# Altium project FMC_ADC.PrjPcb (part 3 of 4)

## Sheet ANALOG_INPUT.SchDoc: Analog Input
size A3; Author: Wojciech Ruc³o; Organization: Warsaw Univeristy of Technology; Address1: Nowowiejska 15/19; DocumentNumber: 3; Revision: 1.0; SheetNumber: 3; SheetTotal: 12
Used 4 times, as channels U_ANALOG_INPUT_D, U_ANALOG_INPUT_C, U_ANALOG_INPUT_B, U_ANALOG_INPUT_A. Parts and nets are listed once, with the designators drawn on the sheet.
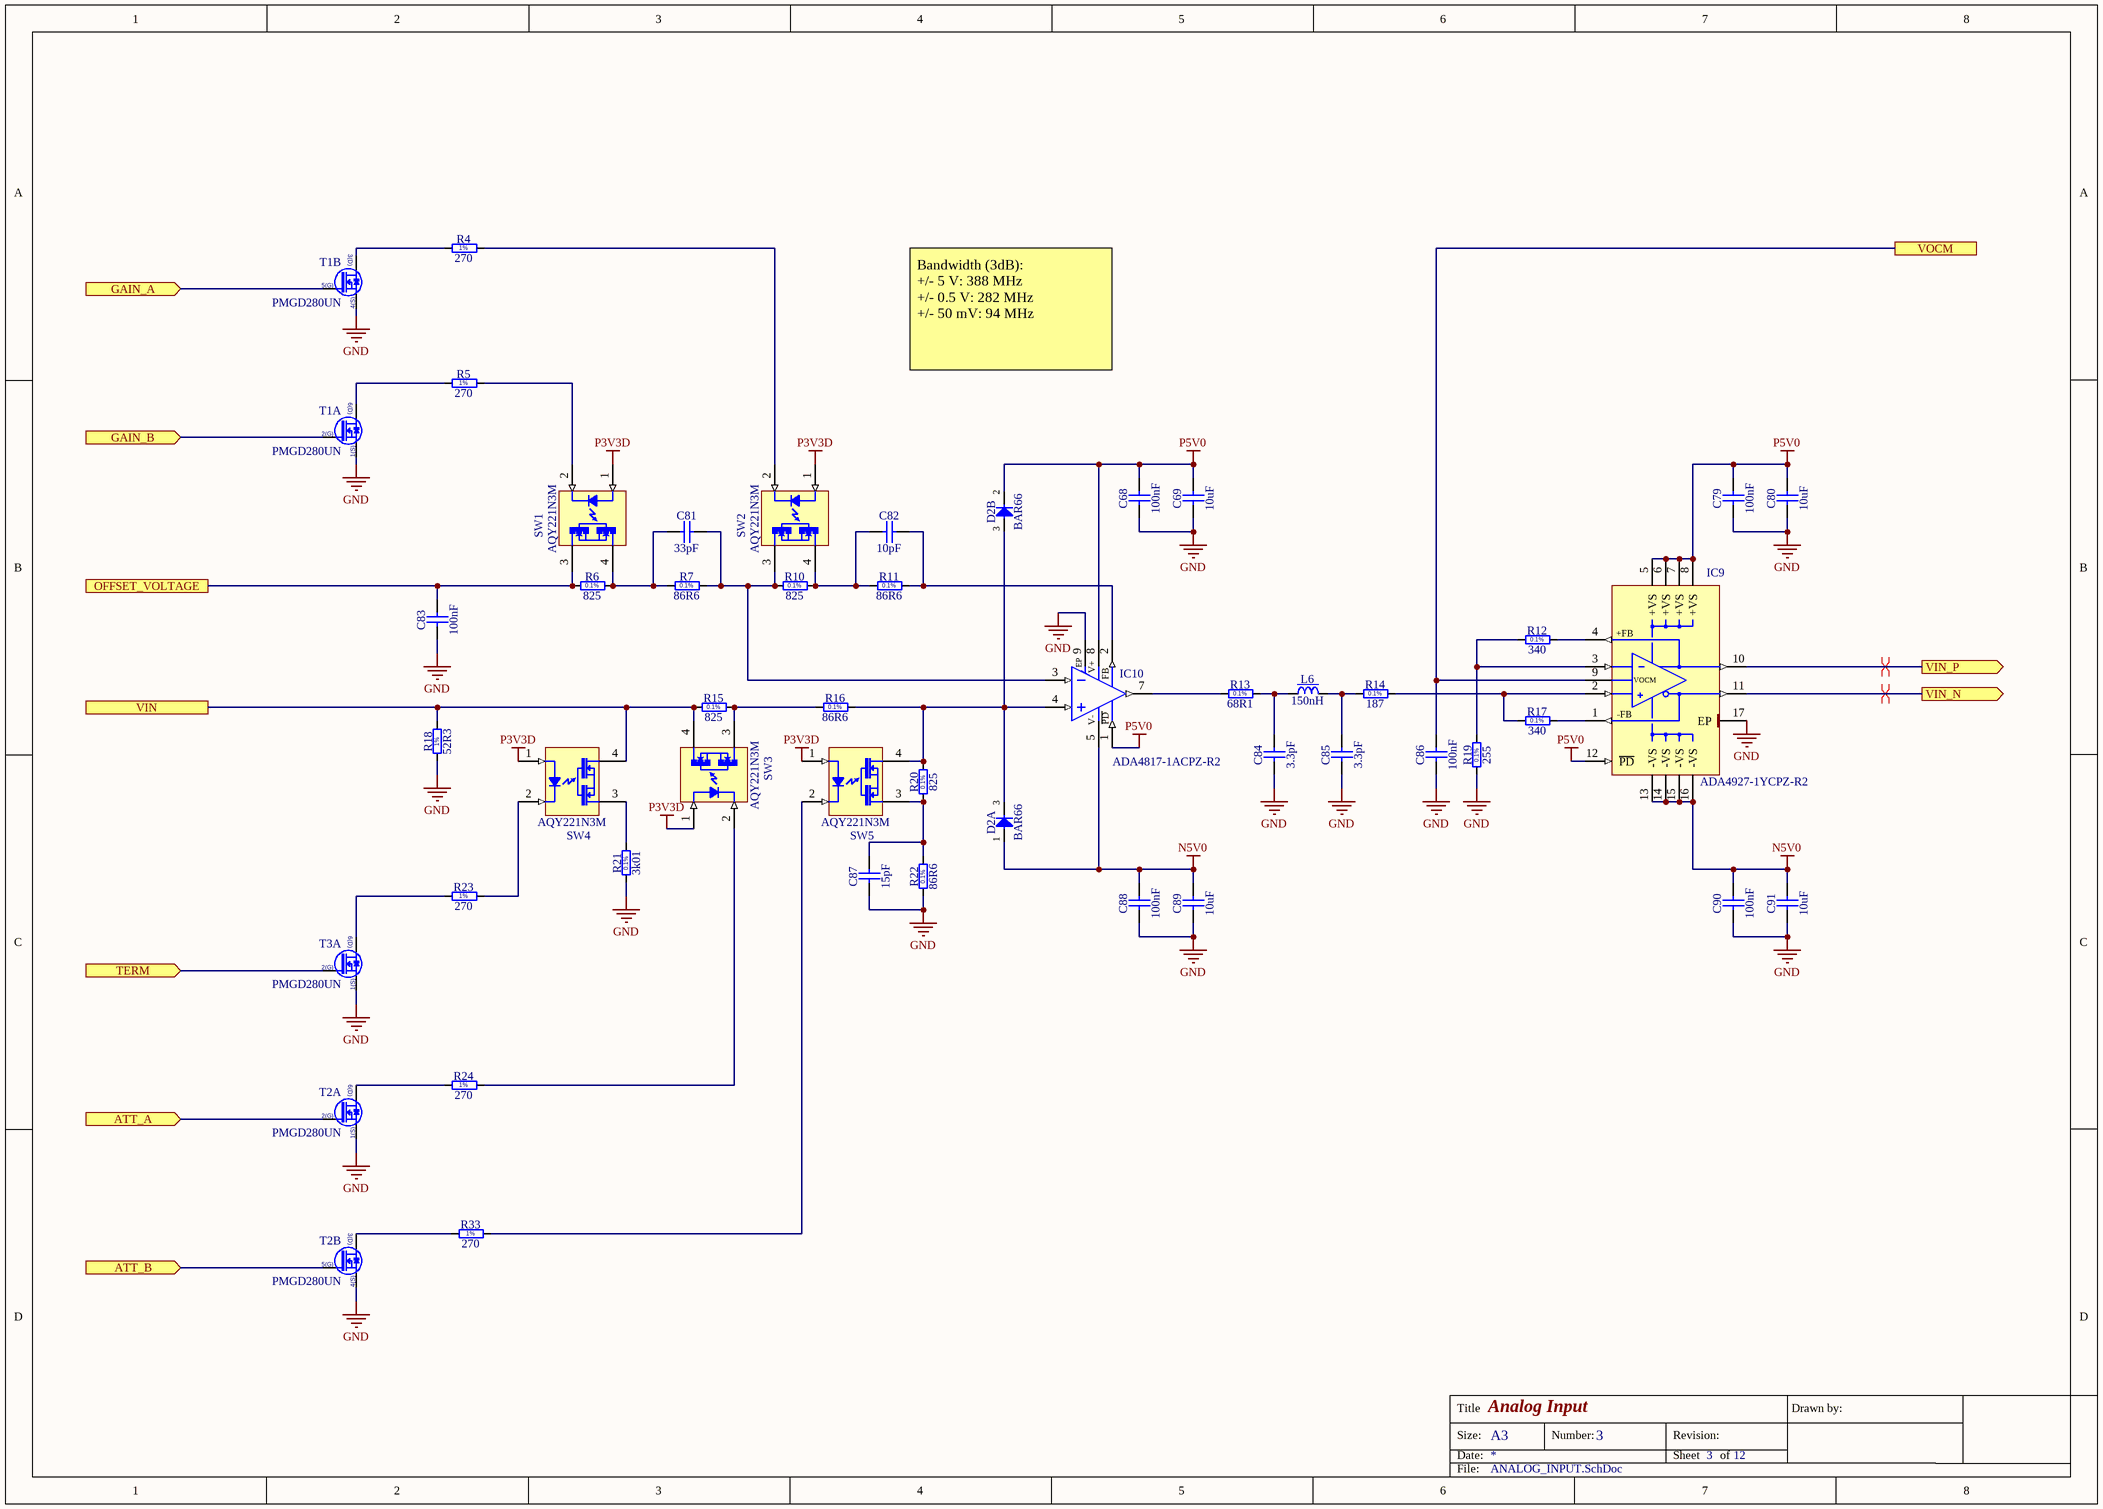
[diagram p6: ANALOG_INPUT.SchDoc]

### Parts
C68  100nF  [CAPC1005X55N]
C69  10uF  [CAPC1608X80N]
C79  100nF  [CAPC1005X55N]
C80  10uF  [CAPC1608X80N]
C81  33pF  [CAPC1608X87N]
C82  10pF  [CAPC1608X87N]
C83  100nF  [CAPC1005X55N]
C84  3.3pF  [CAPC1005X55N]
C85  3.3pF  [CAPC1005X55N]
C86  100nF  [CAPC1005X55N]
C87  15pF  [CAPC1005X55N]
C88  100nF  [CAPC1005X55N]
C89  10uF  [CAPC1608X80N]
C90  100nF  [CAPC1005X55N]
C91  10uF  [CAPC1608X80N]
D2  BAR66  [SOT95P240X110-3N]  (parts A,B of 2)
IC9  ADA4927-1YCPZ-R2  [QFN50P300X300X100-17N-S145]
IC10  ADA4817-1ACPZ-R2  [SON50P300X300X90-9N-R160X189]
L6  150nH  [IND_COILCRAFT_0805CS]
R4  270  [RESC1608X55N]
R5  270  [RESC1608X55N]
R6  825  [RESC1608X55N]
R7  86R6  [RESC1608X55N]
R10  825  [RESC1608X55N]
R11  86R6  [RESC1608X55N]
R12  340  [RESC1608X55N]
R13  68R1  [RESC1608X55N]
R14  187  [RESC1608X55N]
R15  825  [RESC1608X55N]
R16  86R6  [RESC1608X55N]
R17  340  [RESC1608X55N]
R18  52R3  [RESC6331X70N]
R19  255  [RESC1608X55N]
R20  825  [RESC1608X55N]
R21  3k01  [RESC1608X55N]
R22  86R6  [RESC1608X55N]
R23  270  [RESC1608X55N]
R24  270  [RESC1608X55N]
R33  270  [RESC1608X55N]
SW1  AQY221N3M  [PANASONIC_AQY22(SON)]
SW2  AQY221N3M  [PANASONIC_AQY22(SON)]
SW3  AQY221N3M  [PANASONIC_AQY22(SON)]
SW4  AQY221N3M  [PANASONIC_AQY22(SON)]
SW5  AQY221N3M  [PANASONIC_AQY22(SON)]
T1  PMGD280UN  [SOT65P210X110-6N]  (parts A,B of 2)
T2  PMGD280UN  [SOT65P210X110-6N]  (parts A,B of 2)
T3  PMGD280UN  [SOT65P210X110-6N]  (part A of 2)

### Ports
ATT_A (in), ATT_B (in), GAIN_A (in), GAIN_B (in), OFFSET_VOLTAGE, TERM (in), VIN, VIN_N (out), VIN_P (out), VOCM

### Nets
GND: C68.1 C69.1 C79.1 C80.1 C83.1 C84.1 C85.1 C86.1 C87.1 C88.1 C89.1 C90.1 C91.1 IC9.17(EP) IC10.9(EP) R18.1 R19.1 R21.1 R22.1 T1.1(S) T1.4(S) T2.1(S) T2.4(S) T3.1(S)
N5V0: C88.2 C89.2 C90.2 C91.2 D2.1(A) IC9.13(-VS) IC9.14(-VS) IC9.15(-VS) IC9.16(-VS) IC10.5(-Vs)
P3V3D: SW1.1(A) SW2.1(A) SW3.1(A) SW4.1(A) SW5.1(A)
P5V0: C68.2 C69.2 C79.2 C80.2 D2.2(C) IC9.5(+VS) IC9.6(+VS) IC9.7(+VS) IC9.8(+VS) IC9.12(~{PD}) IC10.1(~{PD}) IC10.8(+Vs)
ATT_A: T2.2(G) ; port ATT_A
ATT_B: T2.5(G) ; port ATT_B
GAIN_A: T1.5(G) ; port GAIN_A
GAIN_B: T1.2(G) ; port GAIN_B
OFFSET_VOLTAGE: C83.2 R6.1 SW1.3(C) ; port OFFSET_VOLTAGE
TERM: T3.2(G) ; port TERM
VIN: R15.1 R18.2 SW3.4(E) SW4.4(E) ; port VIN
VIN_N: IC9.11(-OUT) ; port VIN_N
VIN_P: IC9.10(+OUT) ; port VIN_P
VOCM: C86.2 IC9.9(VOCM) ; port VOCM
NetC81_1: C81.1 R6.2 R7.1 SW1.4(E)
NetC81_2: C81.2 IC10.3(IN-) R7.2 R10.1 SW2.3(C)
NetC82_1: C82.1 R10.2 R11.1 SW2.4(E)
NetC82_2: C82.2 IC10.2(FB) R11.2
NetC84_2: C84.2 L6.1 R13.2
NetC85_2: C85.2 L6.2 R14.1
NetC87_2: C87.2 R20.1 R22.2 SW5.3(C)
NetD2_3: D2.3(COMAC) IC10.4(IN+) R16.2 R20.2 SW5.4(E)
NetIC9_1: IC9.1(-FB) R17.2
NetIC9_2: IC9.2(+IN) R14.2 R17.1
NetIC9_3: IC9.3(-IN) R12.1 R19.2
NetIC9_4: IC9.4(+FB) R12.2
NetIC10_7: IC10.7(OUT) R13.1
NetR4_1: R4.1 T1.3(D)
NetR4_2: R4.2 SW2.2(K)
NetR5_1: R5.1 T1.6(D)
NetR5_2: R5.2 SW1.2(K)
NetR15_2: R15.2 R16.1 SW3.3(C)
NetR21_2: R21.2 SW4.3(C)
NetR23_1: R23.1 T3.6(D)
NetR23_2: R23.2 SW4.2(K)
NetR24_1: R24.1 T2.6(D)
NetR24_2: R24.2 SW3.2(K)
NetR33_1: R33.1 T2.3(D)
NetR33_2: R33.2 SW5.2(K)

### Channels
U_ANALOG_INPUT_D: designators end in A; ports ATT_A=ATT_A_CH4 ATT_B=ATT_B_CH4 GAIN_A=GAIN_A_CH4 GAIN_B=GAIN_B_CH4 OFFSET_VOLTAGE=OFFSET_CH4 TERM=LA06_N VIN=NetJ4_1 VIN_N=VIND_N VIN_P=VIND_P VOCM=VOCM
U_ANALOG_INPUT_C: designators end in B; ports ATT_A=ATT_A_CH3 ATT_B=ATT_B_CH3 GAIN_A=GAIN_A_CH3 GAIN_B=GAIN_B_CH3 OFFSET_VOLTAGE=OFFSET_CH3 TERM=LA09_P VIN=NetJ3_1 VIN_N=VINC_N VIN_P=VINC_P VOCM=VOCM
U_ANALOG_INPUT_B: designators end in C; ports ATT_A=ATT_A_CH2 ATT_B=ATT_B_CH2 GAIN_A=GAIN_A_CH2 GAIN_B=GAIN_B_CH2 OFFSET_VOLTAGE=OFFSET_CH2 TERM=LA25_N VIN=NetJ2_1 VIN_N=VINB_N VIN_P=VINB_P VOCM=VOCM
U_ANALOG_INPUT_A: designators end in D; ports ATT_A=ATT_A_CH1 ATT_B=ATT_B_CH1 GAIN_A=GAIN_A_CH1 GAIN_B=GAIN_B_CH1 OFFSET_VOLTAGE=OFFSET_CH1 TERM=LA26_P VIN=NetJ1_1 VIN_N=VINA_N VIN_P=VINA_P VOCM=VOCM

### Layout directives
differential pair: VIND_N, VIND_P

### Notes on the sheet
- Bandwidth (3dB):
  +/- 5 V: 388 MHz
  +/- 0.5 V: 282 MHz
  +/- 50 mV: 94 MHz
- Title
- Size:
- Date:
- A3
- Number:
- Revision:
- Sheet
- of
- Drawn by:
- File:
- (in symbol ADA4817-1ACPZ-R2) V+; PD; V-
- (in symbol PMGD280UN, part A) 6(D); 2(G); 1(S)
- (in symbol PMGD280UN, part B) 3(D); 5(G); 4(S)
- (in symbol R0603_3K01_0.1%_0.063W_10PPM) 0.1%
- (in symbol R0603_68R1_0.1%_0.063W_10PPM) 0.1%
- (in symbol R0603_86R6_0.1%_0.1W_15PPM) 0.1%
- (in symbol R0603_187R_0.1%_0.063W_10PPM) 0.1%
- (in symbol R0603_255R_0.1%_0.063W_10PPM) 0.1%
- (in symbol R0603_270R_1%_0.1W_100PPM) 1%
- (in symbol R0603_340R_0.1%_0.063W_10PPM) 0.1%
- (in symbol R0603_825R_0.1%_0.063W_10PPM) 0.1%
- (in symbol R2512_52R3_1%_1W_100PPM) 1%

### Library data of the parts
C68 C79 C83 C86 C88 C90 = CC0402_100NF_16V_10%_X7R: Non-polarised capacitor; Part Description: SMD Multilayer Chip Ceramic Capacitor; Manufacturer: GENERIC; Manufacturer1 Part Number: GRM155R71C104KA88D; Voltage: 16V; TC: X7R; Tolerance: ±10%; Part Number: CC0402_100NF_16V_10%_X7R; Component Kind: Standard; Component Type: Standard; Pin Count: 2; Value: 100nF; Status: Not Recommended; Manufacturer Part Number: CC0402_100NF_16V_10%_X7R; Case: 0402; Mounted: Yes; Socket: No; SMD: Yes; Sense: No; Manufacturer1 Example: MURATA; Manufacturer1 ComponentHeight: 0.55mm; HelpURL: \\cern.ch\dfs\Applications\Altium\Datasheets\CC0402_X7R_MURATA_GRM.pdf; Author: CERN DEM JLC; CreateDate: 05.12.2013; LatestRevisionDate: 03.12.2007
C69 C80 C89 C91 = CC0603_10UF_16V_20%_X5R: Non-polarised capacitor; Part Description: SMD Multilayer Chip Ceramic Capacitor; Manufacturer: GENERIC; Manufacturer1 Part Number: GRM188R61C106MA73D; Voltage: 16V; TC: X5R; Tolerance: ±20%; Part Number: CC0603_10UF_16V_20%_X5R; Component Kind: Standard; Component Type: Standard; Pin Count: 2; Value: 10uF; Status: None; Manufacturer Part Number: CC0603_10UF_16V_20%_X5R; Case: 0603; Mounted: Yes; Socket: No; SMD: Yes; Sense: No; Manufacturer1 Example: MURATA; Manufacturer1 ComponentHeight: 0.8mm; HelpURL: \\cern.ch\dfs\Applications\Altium\Datasheets\CC0603_X5R_MURATA_GRM.pdf; Author: CERN DEM MR; CreateDate: 02.03.2016; LatestRevisionDate: 02.03.2016
C81 = CC0603_33PF_50V_5%_NP0: Non-polarised capacitor; Part Description: SMD Multilayer Chip Ceramic Capacitor; Manufacturer: GENERIC; Manufacturer1 Part Number: 223886715339; Voltage: 50V; TC: C0G/NP0; Tolerance: ±5%; Part Number: CC0603_33PF_50V_5%_NP0; Component Kind: Standard; Component Type: Standard; Pin Count: 2; Value: 33pF; Status: Preferred; Manufacturer Part Number: CC0603_33PF_50V_5%_NP0; Case: 0603; Mounted: Yes; Socket: No; SMD: Yes; Sense: No; Manufacturer1 Example: PHYCOMP; Manufacturer1 ComponentHeight: 0.87mm; HelpURL: \\cern.ch\dfs\Applications\Altium\Datasheets\CC0603_NP0_PHYCOMP.pdf; Author: CERN DEM JLC; CreateDate: 03.12.2007; LatestRevisionDate: 03.12.2007
C82 = CC0603_10PF_50V_5%_NP0: Non-polarised capacitor; Part Description: SMD Multilayer Chip Ceramic Capacitor; Manufacturer: GENERIC; Manufacturer1 Part Number: 223886715109; Voltage: 50V; TC: C0G/NP0; Tolerance: ±5%; Part Number: CC0603_10PF_50V_5%_NP0; Component Kind: Standard; Component Type: Standard; Pin Count: 2; Value: 10pF; Status: Preferred; Manufacturer Part Number: CC0603_10PF_50V_5%_NP0; Case: 0603; Mounted: Yes; Socket: No; SMD: Yes; Sense: No; Manufacturer1 Example: PHYCOMP; Manufacturer1 ComponentHeight: 0.87mm; HelpURL: \\cern.ch\dfs\Applications\Altium\Datasheets\CC0603_NP0_PHYCOMP.pdf; Author: CERN DEM JLC; CreateDate: 03.12.2007; LatestRevisionDate: 03.12.2007
C84 C85 = CC0402_3.3PF_50V_0.25PF_C0G: Non-polarised capacitor; Part Description: SMD Multilayer Chip Ceramic Capacitor; Manufacturer: GENERIC; Manufacturer1 Part Number: C0402C339C5GACTU; Voltage: 50V; TC: C0G/NP0; Tolerance: ±0.25pF; Part Number: CC0402_3.3PF_50V_0.25PF_C0G; Component Kind: Standard; Component Type: Standard; Pin Count: 2; Value: 3.3pF; Status: Preferred; Manufacturer Part Number: CC0402_3.3PF_50V_0.25PF_C0G; Case: 0402; Mounted: Yes; Socket: No; SMD: Yes; Sense: No; Manufacturer1 Example: KEMET; Manufacturer1 ComponentHeight: 0.55mm; HelpURL: \\cern.ch\dfs\Applications\Altium\Datasheets\CC0805_C0G_KEMET_(Commercial Grade).pdf; Author: CERN DEM JLC; CreateDate: 03.12.2007; LatestRevisionDate: 22.04.2015
C87 = CC0402_15PF_50V_5%_C0G: Non-polarised capacitor; Part Description: SMD Multilayer Chip Ceramic Capacitor; Manufacturer: GENERIC; Manufacturer1 Part Number: C0402C150J5GACTU; Voltage: 50V; TC: C0G/NP0; Tolerance: ±5%; Part Number: CC0402_15PF_50V_5%_C0G; Component Kind: Standard; Component Type: Standard; Pin Count: 2; Value: 15pF; Status: Preferred; Manufacturer Part Number: CC0402_15PF_50V_5%_C0G; Case: 0402; Mounted: Yes; Socket: No; SMD: Yes; Sense: No; Manufacturer1 Example: KEMET; Manufacturer1 ComponentHeight: 0.55mm; HelpURL: \\cern.ch\dfs\Applications\Altium\Datasheets\CC0805_C0G_KEMET_(Commercial Grade).pdf; Author: CERN DEM JLC; CreateDate: 03.12.2007; LatestRevisionDate: 22.04.2015
D2 = BAR66: Serial Diode; Part Description: Silicon PIN Diode Array (Series Connected); Manufacturer: INFINEON; Voltage: 150V; Power: 250mA; PressFit: No; Bonding: No; Part Number: BAR66; Component Kind: Standard; Component Type: Standard; Device: BAR66; PackageDescription: SOT23 3-Leads, Pitch 0.95mm - Body 1.3x2.9mm, IPC Medium Density; Manufacturer Part Number: BAR66; Pin Count: 3; Case: SOT23; Mounted: Yes; Socket: No; SMD: Yes; Sense: No; ComponentHeight: 1.1mm; HelpURL: \\cern.ch\dfs\Applications\Altium\Datasheets\BAR66.pdf; Author: CERN DEM JLC; CreateDate: 18.01.2010; LatestRevisionDate: 05.10.2010
IC9 = ADA4927-1YCPZ-R2: Ultralow Distortion Current Feedback Differential ADC Driver; Manufacturer: ANALOG DEVICES; PressFit: No; Bonding: No; Part Number: ADA4927-1YCPZ-R2; Component Kind: Standard; Component Type: Standard; Device: ADA4927-1YCPZ-R2; PackageDescription: QFN,0.50mm pitch,square; 4 pin X 4 pin, 3mm X 3mm X 1.00mm H body (w/thermal tab 1.45 X 1.45mm),  IPC Medium Density; Part Description: Ultralow Distortion Current Feedback Differential ADC Driver; Manufacturer Part Number: ADA4927-1YCPZ-R2; Pin Count: 17; Case: QFN16; Mounted: Yes; Socket: No; SMD: Yes; Sense: No; ComponentHeight: 1mm; Author: CERN DEM JLC; HelpURL: \\cern.ch\dfs\Applications\Altium\Datasheets\ADA4927-1YCPZ-R2.pdf; CreateDate: 19.04.2010; LatestRevisionDate: 19.04.2010
IC10 = ADA4817-1ACPZ-R2: Low Noise, 1GHz FastFEET Operational Amplifier; Manufacturer: ANALOG DEVICES; PressFit: No; Bonding: No; Part Number: ADA4817-1ACPZ-R2; Component Kind: Standard; Component Type: Standard; Device: ADA4817-1ACPZ-R2; PackageDescription: SON (DFN), 0.50mm pitch, 8 pin, 3mm X 3mm X 0.9mm H body (w/thermal tab 1.6 X 1.89mm),  IPC Medium Density; Part Description: Low Noise, 1GHz FastFEET Operational Amplifier; Manufacturer Part Number: ADA4817-1ACPZ-R2; Pin Count: 8; Case: SON8; Mounted: Yes; Socket: No; SMD: Yes; Sense: No; ComponentHeight: 0.9mm; Author: CERN DEM JLC; HelpURL: \\cern.ch\dfs\Applications\Altium\Datasheets\ADA4817-1ACPZ-R2.pdf; CreateDate: 01.07.2014; LatestRevisionDate: 01.07.2014
L6 = IND_150NH_2%_COILCRAFT_0805CS: Inductor With Core; Part Description: SMT Chip Inductor; Manufacturer Part Number: 0805CS-151XGLC; Power: 400mA; Resistance: 0.56R; Tolerance: ±2%; Part Number: IND_150NH_2%_COILCRAFT_0805CS; Component Kind: Standard; Component Type: Standard; Pin Count: 2; Value: 150nH; Status: None; Manufacturer: COILCRAFT; Case: 0805; Mounted: Yes; Socket: No; SMD: Yes; Sense: No; ComponentHeight: 1.52mm; HelpURL: \\cern.ch\dfs\Applications\Altium\Datasheets\IND_COILCRAFT_0805CS.pdf; Author: CERN DEM JLC; CreateDate: 03.03.2015; LatestRevisionDate: 03.03.2015
R4 R5 R23 R24 R33 = R0603_270R_1%_0.1W_100PPM: Resistor - 1%; Part Description: General Purpose Thick Film Chip Resistor; Manufacturer: GENERIC; Manufacturer1 Part Number: NRC06F2700TRF; Power: 0.1W; TC: ±100ppm/°C; Part Number: R0603_270R_1%_0.1W_100PPM; Component Kind: Standard; Component Type: Standard; Pin Count: 2; Value: 270; Status: Preferred; Tolerance: ±1%; Manufacturer Part Number: R0603_270R_1%_0.1W_100PPM; Case: 0603; Mounted: Yes; Sense: No; Socket: No; SMD: Yes; Manufacturer1 Example: NIC COMPONENT; Manufacturer1 ComponentHeight: 0.55mm; HelpURL: \\cern.ch\dfs\Applications\Altium\Datasheets\R0603_NIC_NRC.pdf; Author: CERN DEM JLC; CreateDate: 03.12.2007; LatestRevisionDate: 13.03.2008
R6 R10 R15 R20 = R0603_825R_0.1%_0.063W_10PPM: Resistor - 0.1%; Part Description: Thin Film Chip Resistor; Manufacturer: GENERIC; Manufacturer1 Part Number: RN73C1J825RBTDF; Power: 0.063W; TC: ±10ppm; Part Number: R0603_825R_0.1%_0.063W_10PPM; Component Kind: Standard; Component Type: Standard; Pin Count: 2; Value: 825; Status: Not recommended; Tolerance: ±0.1%; Manufacturer Part Number: R0603_825R_0.1%_0.063W_10PPM; Case: 0603; Mounted: Yes; Sense: No; Socket: No; SMD: Yes; Manufacturer1 Example: TYCO HOLSWORTHY; Manufacturer1 ComponentHeight: 0.5mm; HelpURL: \\cern.ch\dfs\Applications\Altium\Datasheets\R0603_Tyco_RN73.pdf; Author: CERN DEM JLC; CreateDate: 03.12.2007; LatestRevisionDate: 13.03.2008
R7 R11 R16 R22 = R0603_86R6_0.1%_0.1W_15PPM: Resistor - 0.1%; Part Description: Thin Film Chip Resistor; Manufacturer: GENERIC; Manufacturer1 Part Number: RP73D1J86R6BTDG; Power: 0.1W; TC: ±15ppm; Part Number: R0603_86R6_0.1%_0.1W_15PPM; Component Kind: Standard; Component Type: Standard; Pin Count: 2; Value: 86R6; Status: Not recommended; Tolerance: ±0.1%; Manufacturer Part Number: R0603_86R6_0.1%_0.1W_15PPM; Case: 0603; Mounted: Yes; Sense: No; Socket: No; SMD: Yes; Manufacturer1 Example: TYCO HOLSWORTHY; Manufacturer1 ComponentHeight: 0.5mm; HelpURL: \\cern.ch\dfs\Applications\Altium\Datasheets\R0603_TYCO_RP73.pdf; Author: CERN DEM JLC; CreateDate: 26.01.2010; LatestRevisionDate: 26.01.2010
R12 R17 = R0603_340R_0.1%_0.063W_10PPM: Resistor - 0.1%; Part Description: Thin Film Chip Resistor; Manufacturer: GENERIC; Manufacturer1 Part Number: RN73C1J340RBTDF; Power: 0.063W; TC: ±10ppm; Part Number: R0603_340R_0.1%_0.063W_10PPM; Component Kind: Standard; Component Type: Standard; Pin Count: 2; Value: 340; Status: Not recommended; Tolerance: ±0.1%; Manufacturer Part Number: R0603_340R_0.1%_0.063W_10PPM; Case: 0603; Mounted: Yes; Sense: No; Socket: No; SMD: Yes; Manufacturer1 Example: TYCO HOLSWORTHY; Manufacturer1 ComponentHeight: 0.5mm; HelpURL: \\cern.ch\dfs\Applications\Altium\Datasheets\R0603_Tyco_RN73.pdf; Author: CERN DEM JLC; CreateDate: 03.12.2007; LatestRevisionDate: 13.03.2008
R13 = R0603_68R1_0.1%_0.063W_10PPM: Resistor - 0.1%; Part Description: Thin Film Chip Resistor; Manufacturer: GENERIC; Manufacturer1 Part Number: RN73C1J68R1BTDF; Power: 0.063W; TC: ±10ppm; Part Number: R0603_68R1_0.1%_0.063W_10PPM; Component Kind: Standard; Component Type: Standard; Pin Count: 2; Value: 68R1; Status: Not recommended; Tolerance: ±0.1%; Manufacturer Part Number: R0603_68R1_0.1%_0.063W_10PPM; Case: 0603; Mounted: Yes; Sense: No; Socket: No; SMD: Yes; Manufacturer1 Example: TYCO HOLSWORTHY; Manufacturer1 ComponentHeight: 0.5mm; HelpURL: \\cern.ch\dfs\Applications\Altium\Datasheets\R0603_Tyco_RN73.pdf; Author: CERN DEM JLC; CreateDate: 03.12.2007; LatestRevisionDate: 13.03.2008
R14 = R0603_187R_0.1%_0.063W_10PPM: Resistor - 0.1%; Part Description: Thin Film Chip Resistor; Manufacturer: GENERIC; Manufacturer1 Part Number: RN73C1J187RBTDF; Power: 0.063W; TC: ±10ppm; Part Number: R0603_187R_0.1%_0.063W_10PPM; Component Kind: Standard; Component Type: Standard; Pin Count: 2; Value: 187; Status: Not recommended; Tolerance: ±0.1%; Manufacturer Part Number: R0603_187R_0.1%_0.063W_10PPM; Case: 0603; Mounted: Yes; Sense: No; Socket: No; SMD: Yes; Manufacturer1 Example: TYCO HOLSWORTHY; Manufacturer1 ComponentHeight: 0.5mm; HelpURL: \\cern.ch\dfs\Applications\Altium\Datasheets\R0603_Tyco_RN73.pdf; Author: CERN DEM JLC; CreateDate: 03.12.2007; LatestRevisionDate: 13.03.2008
R18 = R2512_52R3_1%_1W_100PPM: Resistor - 1%; Part Description: Thick Film Chip Resistor; Manufacturer: GENERIC; Manufacturer1 Part Number: ERJ-1TNF52R3U; Power: 1W; TC: ±100ppm/°C; Part Number: R2512_52R3_1%_1W_100PPM; Component Kind: Standard; Component Type: Standard; Pin Count: 2; Value: 52R3; Status: Preferred; Tolerance: ±1%; Manufacturer Part Number: R2512_52R3_1%_1W_100PPM; Case: 2512; Mounted: Yes; Sense: No; Socket: No; SMD: Yes; Manufacturer1 Example: Panasonic; Manufacturer1 ComponentHeight: 0.65mm; Author: *
R19 = R0603_255R_0.1%_0.063W_10PPM: Resistor - 0.1%; Part Description: Thin Film Chip Resistor; Manufacturer: GENERIC; Manufacturer1 Part Number: RN73C1J255RBTDF; Power: 0.063W; TC: ±10ppm; Part Number: R0603_255R_0.1%_0.063W_10PPM; Component Kind: Standard; Component Type: Standard; Pin Count: 2; Value: 255; Status: Not recommended; Tolerance: ±0.1%; Manufacturer Part Number: R0603_255R_0.1%_0.063W_10PPM; Case: 0603; Mounted: Yes; Sense: No; Socket: No; SMD: Yes; Manufacturer1 Example: TYCO HOLSWORTHY; Manufacturer1 ComponentHeight: 0.5mm; HelpURL: \\cern.ch\dfs\Applications\Altium\Datasheets\R0603_Tyco_RN73.pdf; Author: CERN DEM JLC; CreateDate: 03.12.2007; LatestRevisionDate: 13.03.2008
R21 = R0603_3K01_0.1%_0.063W_10PPM: Resistor - 0.1%; Part Description: Thin Film Chip Resistor; Manufacturer: GENERIC; Manufacturer1 Part Number: RN73C1J3K01BTDF; Power: 0.063W; TC: ±10ppm; Part Number: R0603_3K01_0.1%_0.063W_10PPM; Component Kind: Standard; Component Type: Standard; Pin Count: 2; Value: 3k01; Status: Not recommended; Tolerance: ±0.1%; Manufacturer Part Number: R0603_3K01_0.1%_0.063W_10PPM; Case: 0603; Mounted: Yes; Sense: No; Socket: No; SMD: Yes; Manufacturer1 Example: TYCO HOLSWORTHY; Manufacturer1 ComponentHeight: 0.5mm; HelpURL: \\cern.ch\dfs\Applications\Altium\Datasheets\R0603_Tyco_RN73.pdf; Author: CERN DEM JLC; CreateDate: 03.12.2007; LatestRevisionDate: 13.03.2008
SW1-SW5 = AQY221N3M: PhotoMOS Relay; Part Description: Micro-miniature SON Package Lower Output Capacitance and On Resistance (C×R5) 25V Load Voltage PhotoMOS Relay; Manufacturer: PANASONIC ELECTRIC WORKS; Table: Optocouplers; Part Number: AQY221N3M; Component Kind: Standard; Component Type: Standard; Device: AQY221N3M; PackageDescription: PANASONIC Serie AQY22(SON)  Small Outline No Lead, 4 pins, 2.2x2.95mm; Manufacturer Part Number: AQY221N3M; Pin Count: 4; Case: SON4; Mounted: Yes; Socket: No; SMD: Yes; ComponentHeight: 1.4mm; HelpURL: \\cern.ch\dfs\Applications\Altium\Datasheets\AQY221N3M.pdf; ComponentLink1Description: Package Drawing; ComponentLink1URL: \\cern.ch\dfs\Applications\Altium\Datasheets\AQY221N3M_Package-Drawing.pdf; Author: CERN DEM JLC; CreateDate: 18/01/2010; LatestRevisionDate: 18/01/2010
T1-T3 = PMGD280UN: Dual N-Channel micro TrenchMOS™ Ultra Low Level FET; Part Description: 20V 870mA Dual N-Channel micro TrenchMOS™ Ultra Low Level FET; Manufacturer: NXP SEMICONDUCTORS; PressFit: No; Bonding: No; Part Number: PMGD280UN; Component Kind: Standard; Component Type: Standard; Device: PMGD280UN; PackageDescription: SOT363, SC70-6, SOT, 0.65mm Pitch, 6 pin, 1.25mm W X 2.00mm L X 1.10mm H, IPC Medium Density; Manufacturer Part Number: PMGD280UN; Pin Count: 6; Case: SOT363; Mounted: Yes; Socket: No; SMD: Yes; Sense: No; ComponentHeight: 1.1mm; HelpURL: \\cern.ch\dfs\Applications\Altium\Datasheets\PMGD280UN.pdf; Author: CERN DEM JLC; CreateDate: 19.11.2014; LatestRevisionDate: 19.11.2014

## Sheet LEVEL_TRANSLATORS.SchDoc: Level Translators
size A3; Author: Wojciech Ruc³o; Organization: Warsaw Univeristy of Technology; Address1: Nowowiejska 15/19; DocumentNumber: 7; Revision: 1.0; SheetNumber: 7; SheetTotal: 12
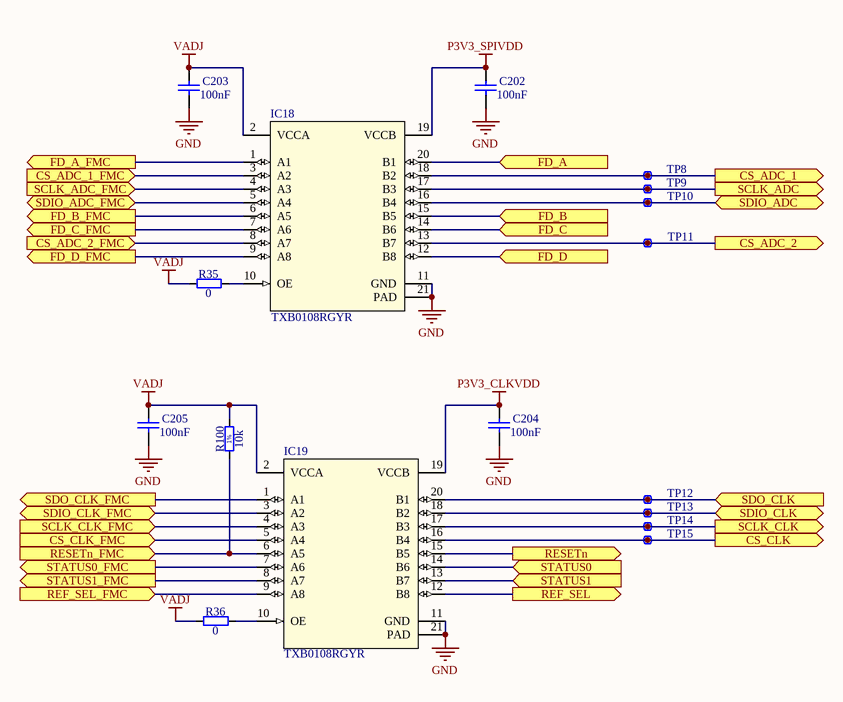
[diagram p7: LEVEL_TRANSLATORS.SchDoc]

### Parts
C202  100nF  [CAPC0603X33N]
C203  100nF  [CAPC0603X33N]
C204  100nF  [CAPC0603X33N]
C205  100nF  [CAPC0603X33N]
IC18  TXB0108RGYR  [RGY20_3P05x2P05]
IC19  TXB0108RGYR  [RGY20_3P05x2P05]
R35  0  [RESC1005X40N]
R36  0  [RESC1005X40N]
R100  10k  [RESC1005X40N]
TP8  Test Point  [TPS62]  (value not drawn)
TP9  Test Point  [TPS62]  (value not drawn)
TP10  Test Point  [TPS62]  (value not drawn)
TP11  Test Point  [TPS62]  (value not drawn)
TP12  Test Point  [TPS62]  (value not drawn)
TP13  Test Point  [TPS62]  (value not drawn)
TP14  Test Point  [TPS62]  (value not drawn)
TP15  Test Point  [TPS62]  (value not drawn)

### Ports
CS_ADC_1 (out), CS_ADC_1_FMC (in), CS_ADC_2 (out), CS_ADC_2_FMC (in), CS_CLK (out), CS_CLK_FMC (in), FD_A (in), FD_A_FMC (out), FD_B (in), FD_B_FMC (out), FD_C (in), FD_C_FMC (out), FD_D (in), FD_D_FMC (out), REF_SEL (out), REF_SEL_FMC (in), RESETn (out), RESETn_FMC (in), SCLK_ADC (out), SCLK_ADC_FMC (in), SCLK_CLK (out), SCLK_CLK_FMC (in), SDIO_ADC (bidir), SDIO_ADC_FMC (bidir), SDIO_CLK (bidir), SDIO_CLK_FMC (bidir), SDO_CLK (in), SDO_CLK_FMC (out), STATUS0 (in), STATUS0_FMC (out), STATUS1 (in), STATUS1_FMC (out)

### Nets
GND: C202.1 C203.1 C204.1 C205.1 IC18.11(GND) IC18.21(PAD) IC19.11(GND) IC19.21(PAD)
P3V3_CLKVDD: C204.2 IC19.19(VCCB)
P3V3_SPIVDD: C202.2 IC18.19(VCCB)
VADJ: C203.2 C205.2 IC18.2(VCCA) IC19.2(VCCA) R35.1 R36.1 R100.2
CS_ADC1: IC18.18(B2) TP8.1 ; port CS_ADC_1
CS_ADC1_FMC: IC18.3(A2) ; port CS_ADC_1_FMC
CS_ADC2: IC18.13(B7) TP11.1 ; port CS_ADC_2
CS_ADC2_FMC: IC18.8(A7) ; port CS_ADC_2_FMC
CS_CLK: IC19.16(B4) TP15.1 ; port CS_CLK
CS_CLK_FMC: IC19.5(A4) ; port CS_CLK_FMC
FD_A: IC18.20(B1) ; port FD_A
FD_A_FMC: IC18.1(A1) ; port FD_A_FMC
FD_B: IC18.15(B5) ; port FD_B
FD_B_FMC: IC18.6(A5) ; port FD_B_FMC
FD_C: IC18.14(B6) ; port FD_C
FD_C_FMC: IC18.7(A6) ; port FD_C_FMC
FD_D: IC18.12(B8) ; port FD_D
FD_D_FMC: IC18.9(A8) ; port FD_D_FMC
LA13_N: IC19.8(A7) ; port STATUS1_FMC
LA14_N: IC19.3(A2) ; port SDIO_CLK_FMC
LA14_P: IC19.6(A5) R100.1 ; port RESETn_FMC
LA15_N: IC19.4(A3) ; port SCLK_CLK_FMC
LA15_P: IC19.7(A6) ; port STATUS0_FMC
LA16_P: IC19.9(A8) ; port REF_SEL_FMC
LA19_P: IC19.1(A1) ; port SDO_CLK_FMC
LA32_P: IC18.5(A4) ; port SDIO_ADC_FMC
LA33_N: IC18.4(A3) ; port SCLK_ADC_FMC
REF_SEL: IC19.12(B8) ; port REF_SEL
RESETn: IC19.15(B5) ; port RESETn
SCLK_ADC: IC18.17(B3) TP9.1 ; port SCLK_ADC
SCLK_CLK: IC19.17(B3) TP14.1 ; port SCLK_CLK
SDIO_ADC: IC18.16(B4) TP10.1 ; port SDIO_ADC
SDIO_CLK: IC19.18(B2) TP13.1 ; port SDIO_CLK
SDO_CLK: IC19.20(B1) TP12.1 ; port SDO_CLK
STATUS0: IC19.14(B6) ; port STATUS0
STATUS1: IC19.13(B7) ; port STATUS1
NetIC18_10: IC18.10(OE) R35.2
NetIC19_10: IC19.10(OE) R36.2

### Notes on the sheet
- Title
- Size:
- Date:
- A3
- Number:
- Revision:
- Sheet
- of
- Drawn by:
- File:
- (in symbol R0402_10K_1%_0.0625W_100PPM) 1%

### Library data of the parts
C202-C205 = CC0201_100NF_6.3V_10%_X5R: as C44-C62 on sheet CLOCK; Value: 100nF; Part Number: CC0201_100NF_6.3V_10%_X5R; Component Kind: Standard; Component Type: Standard; Pin Count: 2; Status: Not Recommended; Manufacturer Part Number: CC0201_100NF_6.3V_10%_X5R; Case: 0201; Mounted: Yes; Socket: No; SMD: Yes; Sense: No; Manufacturer1 Example: AVX; Manufacturer1 ComponentHeight: 0.33mm; HelpURL: \\cern.ch\dfs\Applications\Altium\Datasheets\CC0201_X5R_AVX.pdf; Author: CERN DEM JLC; CreateDate: 03.12.2007; LatestRevisionDate: 03.12.2007
IC18 IC19 = TXB0108RGYR: 8-Bit Bidirectional Voltage-Level Translator with Auto-Direction Sensing; Manufacturer: Texas Instruments; Application_BuildNumber: *; PackageReference: RGY0020A; RoHS: Y; Manufacturer Part Number: TXB0108RGYR
R35 R36 = R0402_0R_JUMPER: Resistor; Part Description: 1A (0.05R Max DC Resistance) Zero Ohm Jumper; Manufacturer: GENERIC; Manufacturer1 Part Number: 232270591001L; Part Number: R0402_0R_JUMPER; Component Kind: Standard; Component Type: Standard; Pin Count: 2; Value: 0; Status: Not recommended; Manufacturer Part Number: R0402_0R_JUMPER; Case: 0402; Mounted: Yes; Sense: No; Socket: No; SMD: Yes; Manufacturer1 Example: YAGEO PHYCOMP; Manufacturer1 ComponentHeight: 0.4mm; HelpURL: \\cern.ch\dfs\Applications\Altium\Datasheets\R0402_Phycomp_RC0402.pdf; Author: CERN DEM JLC; CreateDate: 03.12.2007; LatestRevisionDate: 17.10.2012
R100 = R0402_10K_1%_0.0625W_100PPM: Resistor - 1%; Part Description: General Purpose Thick Film Chip Resistor; Manufacturer: GENERIC; Manufacturer1 Part Number: 232270671003L; TC: ±100ppm/°C; Part Number: R0402_10K_1%_0.0625W_100PPM; Component Kind: Standard; Component Type: Standard; Pin Count: 2; Value: 10k; Status: Not recommended; Power: 0.0625W; Tolerance: ±1%; Manufacturer Part Number: R0402_10K_1%_0.0625W_100PPM; Case: 0402; Mounted: Yes; Sense: No; Socket: No; SMD: Yes; Manufacturer1 Example: YAGEO PHYCOMP; Manufacturer1 ComponentHeight: 0.4mm; HelpURL: \\cern.ch\dfs\Applications\Altium\Datasheets\R0402_Phycomp_RC0402.pdf; Author: CERN DEM JLC; CreateDate: 03.12.2007; LatestRevisionDate: 17.10.2012
TP8-TP15 = SMD_PAD_0.62X0.62MM: Part Description: 0.62mm x 0.62mm PCB Copper Area (SMD Test Point); Mounted: No; Part Number: SMD_PAD_0.62X0.62MM; Component Kind: Standard (No BOM); Component Type: Standard (No BOM); Pin Count: 1; Family: Test Point; Socket: No; SMD: Yes; Sense: No; Status: None; ComponentHeight: 0mm; HelpURL: Undefined; Author: CERN DEM JLC; CreateDate: 12.01.2008; LatestRevisionDate: 12.01.2008; PackageDescription: 0.62mm x 0.62mm PCB Copper Area (SMD Test Point)

## Sheet POWER_SUPPLY_2.SchDoc: Power Supply
size A3; Author: Wojciech Ruc³o; Organization: Warsaw Univeristy of Technology; Address1: Nowowiejska 15/19; DocumentNumber: 9; Revision: 1.0; SheetNumber: 9; SheetTotal: 12
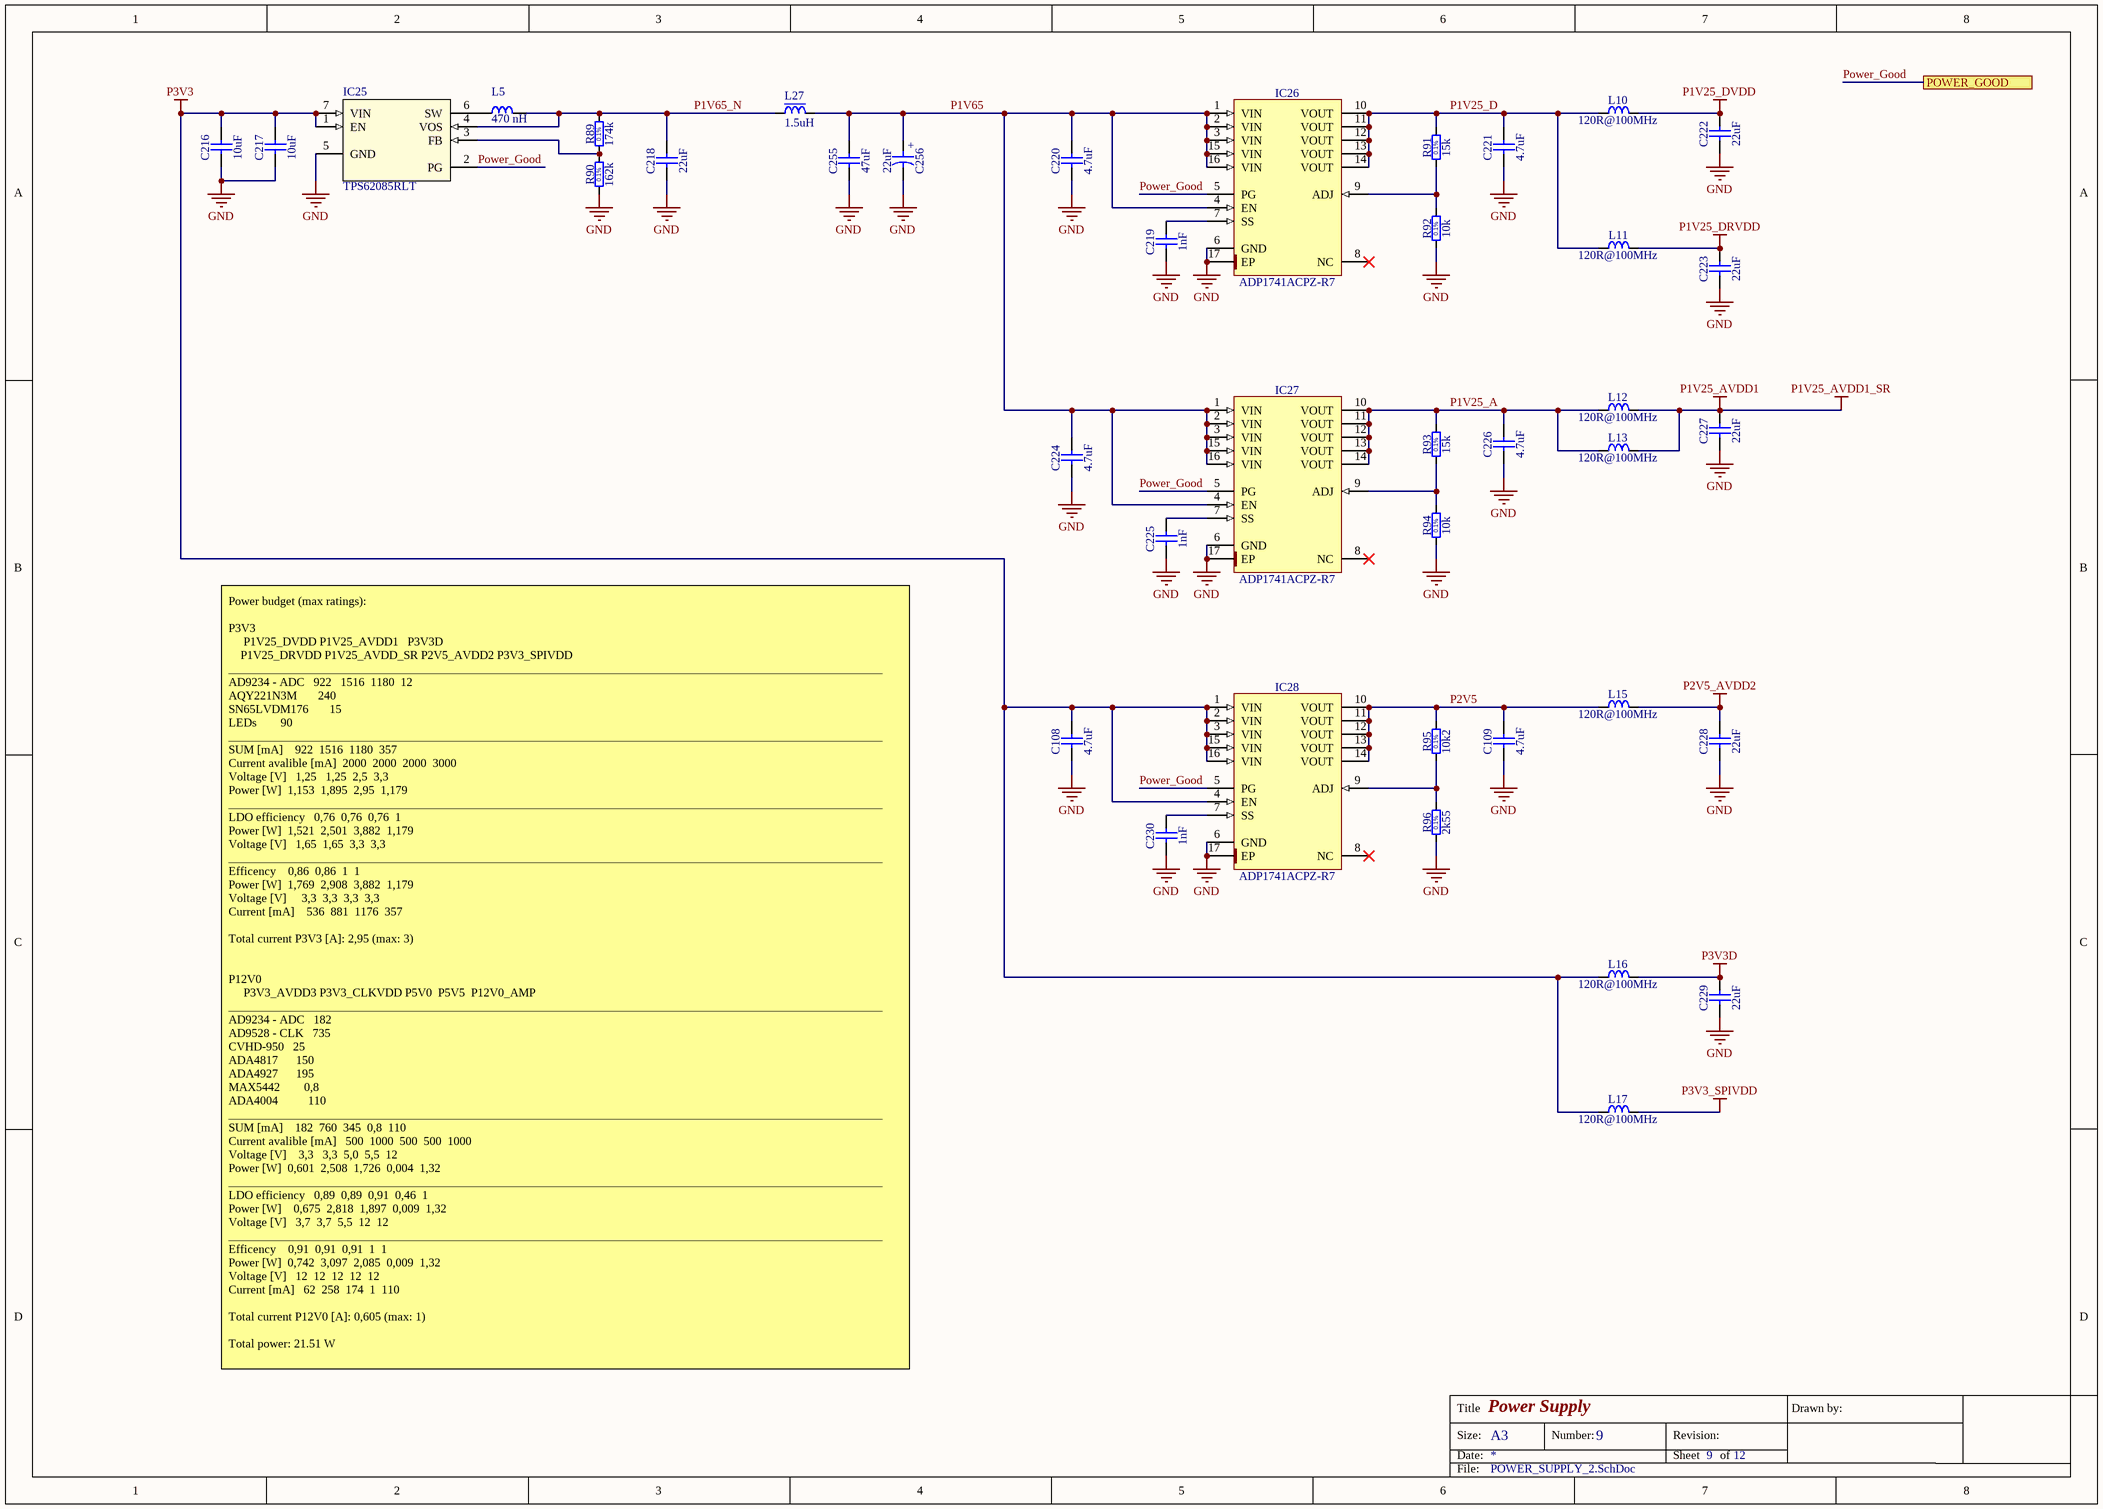
[diagram p8: POWER_SUPPLY_2.SchDoc]

### Parts
C108  4.7uF  [CAPC1709X95N]
C109  4.7uF  [CAPC1709X95N]
C216  10uF  [CAPC1608X87N]
C217  10uF  [CAPC1608X87N]
C218  22uF  [CAPC2012X95N]
C219  1nF  [CAPC0603X33N]
C220  4.7uF  [CAPC1709X95N]
C221  4.7uF  [CAPC1709X95N]
C222  22uF  [CAPC1709X100N]
C223  22uF  [CAPC1709X100N]
C224  4.7uF  [CAPC1709X95N]
C225  1nF  [CAPC0603X33N]
C226  4.7uF  [CAPC1709X95N]
C227  22uF  [CAPC1709X100N]
C228  22uF  [CAPC1709X100N]
C229  22uF  [CAPC1709X100N]
C230  1nF  [CAPC0603X33N]
C255  47uF  [CAPC3225X270N]
C256  22uF  [CAPMP3528X210N]
IC25  TPS62085RLT  [RLT0007A]
IC26  ADP1741ACPZ-R7  [QFN65P400X400X100-17N-S225]
IC27  ADP1741ACPZ-R7  [QFN65P400X400X100-17N-S225]
IC28  ADP1741ACPZ-R7  [QFN65P400X400X100-17N-S225]
L5  470 nH  [IND_IHLP-1212AE]
L10  120R@100MHz  [INDC1608X65N]
L11  120R@100MHz  [INDC1608X65N]
L12  120R@100MHz  [INDC1608X65N]
L13  120R@100MHz  [INDC1608X65N]
L15  120R@100MHz  [INDC1608X65N]
L16  120R@100MHz  [INDC1608X65N]
L17  120R@100MHz  [INDC1608X65N]
L27  1.5uH  [IND_SPM4020]
R89  174k  [RESC2012X60N]
R90  162k  [RESC2012X60N]
R91  15k  [RESC1608X55N]
R92  10k  [RESC1608X55N]
R93  15k  [RESC1608X55N]
R94  10k  [RESC1608X55N]
R95  10k2  [RESC1608X55N]
R96  2k55  [RESC1608X55N]

### Ports
POWER_GOOD

### Nets
GND: C108.1 C109.1 C216.1 C217.1 C218.1 C219.1 C220.1 C221.1 C222.1 C223.1 C224.1 C225.1 C226.1 C227.1 C228.1 C229.1 C230.1 C255.1 C256.2 IC25.5(GND) IC26.6(GND) IC26.17(EP) IC27.6(GND) IC27.17(EP) IC28.6(GND) IC28.17(EP) R90.1 R92.1 R94.1 R96.1
P1V25_AVDD1: C227.2 L12.2 L13.2  [also labelled P1V25_AVDD1_SR]
P1V25_DRVDD: C223.2 L11.2
P1V25_DVDD: C222.2 L10.2
P2V5_AVDD2: C228.2 L15.2
P3V3: C108.2 C216.2 C217.2 IC25.1(EN) IC25.7(VIN) IC28.1(VIN) IC28.2(VIN) IC28.3(VIN) IC28.4(EN) IC28.15(VIN) IC28.16(VIN) L16.1 L17.1  [project net 3P3V]
P3V3_SPIVDD: L17.2
P3V3D: C229.2 L16.2
P1V25_A: C226.2 IC27.10(VOUT) IC27.11(VOUT) IC27.12(VOUT) IC27.13(VOUT) IC27.14(VOUT) L12.1 L13.1 R93.2
P1V25_D: C221.2 IC26.10(VOUT) IC26.11(VOUT) IC26.12(VOUT) IC26.13(VOUT) IC26.14(VOUT) L10.1 L11.1 R91.2
P1V65: C220.2 C224.2 C255.2 C256.1 IC26.1(VIN) IC26.2(VIN) IC26.3(VIN) IC26.4(EN) IC26.15(VIN) IC26.16(VIN) IC27.1(VIN) IC27.2(VIN) IC27.3(VIN) IC27.4(EN) IC27.15(VIN) IC27.16(VIN) L27.2
P1V65_N: C218.2 IC25.4(VOS) L5.1 L27.1 R89.2
P2V5: C109.2 IC28.10(VOUT) IC28.11(VOUT) IC28.12(VOUT) IC28.13(VOUT) IC28.14(VOUT) L15.1 R95.2
POWER_GOOD: IC25.2(PG) IC26.5(PG) IC27.5(PG) IC28.5(PG) ; port POWER_GOOD
NetC219_2: C219.2 IC26.7(SS)
NetC225_2: C225.2 IC27.7(SS)
NetC230_2: C230.2 IC28.7(SS)
NetIC25_3: IC25.3(FB) R89.1 R90.2
NetIC25_6: IC25.6(SW) L5.2
NetIC26_9: IC26.9(ADJ) R91.1 R92.2
NetIC27_9: IC27.9(ADJ) R93.1 R94.2
NetIC28_9: IC28.9(ADJ) R95.1 R96.2

Not connected (* = marked no-connect by the designer): IC26 8(NC)*; IC27 8(NC)*; IC28 8(NC)*

### Notes on the sheet
- Power budget (max ratings):
  P3V3
  P1V25_DVDD	P1V25_AVDD1			P3V3D
  P1V25_DRVDD	P1V25_AVDD_SR	P2V5_AVDD2	P3V3_SPIVDD
  _____________________________________________________________________________________________________________
  AD9234 - ADC	  922 		1516		1180		12
  AQY221N3M							240
  SN65LVDM176							15
  LEDs								90
  _____________________________________________________________________________________________________________
  SUM [mA]	   922		1516		1180		357
  Current avalible [mA]  2000		2000		2000		3000
  Voltage [V]	  1,25 		1,25		2,5		3,3
  Power [W]		1,153		1,895		2,95		1,179
  _____________________________________________________________________________________________________________
  LDO efficiency	  0,76		0,76		0,76		1
  Power [W]		1,521		2,501		3,882		1,179
  Voltage [V]	  1,65		1,65		3,3		3,3
  _____________________________________________________________________________________________________________
  Efficency		  0,86		0,86		1		1
  Power [W]		1,769		2,908		3,882		1,179
  Voltage [V]	    3,3		3,3		3,3		3,3
  Current [mA]	   536		881		1176		357
  Total current P3V3 [A]: 2,95 (max: 3)
  P12V0
  P3V3_AVDD3	P3V3_CLKVDD	P5V0		P5V5		P12V0_AMP	_____________________________________________________________________________________________________________
  AD9234 - ADC	  182
  AD9528 - CLK			735
  CVHD-950			25
  ADA4817						150
  ADA4927						195
  MAX5442								0,8
  ADA4004										110
  _____________________________________________________________________________________________________________
  SUM [mA]	   182		760		345		0,8		110
  Current avalible [mA]   500		1000		500		500		1000
  Voltage [V]	   3,3 		3,3		5,0		5,5		12
  Power [W]		0,601		2,508		1,726		0,004		1,32
  _____________________________________________________________________________________________________________
  LDO efficiency	  0,89		0,89		0,91		0,46		1
  Power [W]	 	 0,675		2,818		1,897		0,009		1,32
  Voltage [V]	  3,7		3,7		5,5		12		12
  _____________________________________________________________________________________________________________
  Efficency		  0,91		0,91		0,91		1		1
  Power [W]		0,742		3,097		2,085		0,009		1,32
  Voltage [V]	  12		12		12		12		12
  Current [mA]	  62		258		174		1		110
  Total current P12V0 [A]: 0,605 (max: 1)
  Total power: 21.51 W
- Title
- Size:
- Date:
- A3
- Number:
- Revision:
- Sheet
- of
- Drawn by:
- File:
- (in symbol CTE3528-21_22UF_10V_10%_LESR0700) +
- (in symbol R0603_2K55_0.1%_0.063W_10PPM) 0.1%
- (in symbol R0603_10K2_0.1%_0.063W_10PPM) 0.1%
- (in symbol R0603_10K_0.1%_0.063W_10PPM) 0.1%
- (in symbol R0603_15K_0.1%_0.063W_10PPM) 0.1%
- (in symbol R0805_162K_0.1%_0.125W_25PPM) 0.1%
- (in symbol R0805_174K_0.1%_0.125W_25PPM) 0.1%

### Library data of the parts
C108 C109 C220 C221 C224 C226 = CC0603_4.7UF_16V_10%_X5R: Non-polarised capacitor; Part Description: SMD Multilayer Chip Ceramic Capacitor; Manufacturer: GENERIC; Manufacturer1 Part Number: EMK107ABJ475KA-T; Voltage: 16V; TC: X5R; Tolerance: ±10%; Part Number: CC0603_4.7UF_16V_10%_X5R; Component Kind: Standard; Component Type: Standard; Pin Count: 2; Value: 4.7uF; Status: None; Manufacturer Part Number: CC0603_4.7UF_16V_10%_X5R; Case: 0603; Mounted: Yes; Socket: No; SMD: Yes; Sense: No; Manufacturer1 Example: TAIYO YUDEN; Manufacturer1 ComponentHeight: 0.95mm; HelpURL: \\cern.ch\dfs\Applications\Altium\Datasheets\CC0603_X7R_TAIYO-YUDEN_HIGH-VALUE.pdf; Author: CERN DEM JLC; CreateDate: 16.12.2013; LatestRevisionDate: 16.09.2014
C216 C217 = CC0603_10UF_6.3V_20%_X5R: Non-polarised capacitor; Part Description: SMD Multilayer Chip Ceramic Capacitor; Manufacturer: GENERIC; Manufacturer1 Part Number: C0603C106M9PAC; Voltage: 6.3V; TC: X5R; Tolerance: ±20%; Part Number: CC0603_10UF_6.3V_20%_X5R; Component Kind: Standard; Component Type: Standard; Pin Count: 2; Value: 10uF; Status: Preferred; Manufacturer Part Number: CC0603_10uF_6.3V_20%_X5R; Case: 0603; Mounted: Yes; Socket: No; SMD: Yes; Sense: No; Manufacturer1 Example: KEMET; Manufacturer1 ComponentHeight: 0.95mm; HelpURL: \\cern.ch\dfs\Applications\Altium\Datasheets\CC0603_X5R_KEMET.pdf; Author: CERN DEM JLC; CreateDate: 03.12.2007; LatestRevisionDate: 03.12.2007
C218 = CC0805_22UF_6.3V_20%_X5R: Non-polarised capacitor, Low ESR; Part Description: SMD Multilayer Chip Ceramic Capacitor; Manufacturer: TAIYO YUDEN; Voltage: 6.3V; TC: X5R; Tolerance: ±20%; ESR: 1m; Part Number: CC0805_22UF_6.3V_20%_X5R; Component Kind: Standard; Component Type: Standard; Pin Count: 2; Value: 22uF; Status: Preferred; Manufacturer Part Number: JMK212ABJ226MD; Case: 0805; Mounted: Yes; Socket: No; SMD: Yes; Sense: No; Manufacturer1 ComponentHeight: 0.85mm; Author: *
C219 C225 C230 = CC0201_1NF_16V_10%_X5R: Non-polarised capacitor; Part Description: SMD Multilayer Chip Ceramic Capacitor; Manufacturer: GENERIC; Manufacturer1 Part Number: 0201YD102KAT2A; Voltage: 16V; TC: X5R; Tolerance: ±10%; Part Number: CC0201_1NF_16V_10%_X5R; Component Kind: Standard; Component Type: Standard; Pin Count: 2; Value: 1nF; Status: Not Recommended; Manufacturer Part Number: CC0201_1NF_16V_10%_X5R; Case: 0201; Mounted: Yes; Socket: No; SMD: Yes; Sense: No; Manufacturer1 Example: AVX; Manufacturer1 ComponentHeight: 0.33mm; HelpURL: \\cern.ch\dfs\Applications\Altium\Datasheets\CC0201_X5R_AVX.pdf; Author: CERN DEM JLC; CreateDate: 03.12.2007; LatestRevisionDate: 03.12.2007
C222 C223 C227-C229 = CC0603_22UF_6.3V_20%_X5R: Non-polarised capacitor; Part Description: SMD Multilayer Chip Ceramic Capacitor; Manufacturer: GENERIC; Manufacturer1 Part Number: C1608X5R0J226M080AC; Voltage: 6.3V; TC: X5R; Tolerance: ±20%; Part Number: CC0603_22UF_6.3V_20%_X5R; Component Kind: Standard; Component Type: Standard; Pin Count: 2; Value: 22uF; Status: None; Manufacturer Part Number: CC0603_22UF_6.3V_20%_X5R; Case: 0603; Mounted: Yes; Socket: No; SMD: Yes; Sense: No; Manufacturer1 Example: TDK; Manufacturer1 ComponentHeight: 1mm; HelpURL: \\cern.ch\dfs\Applications\Altium\Datasheets\CC0603_X5R_TDK_C.pdf; Author: CERN DEM JLC; CreateDate: 16.12.2013; LatestRevisionDate: 13.09.2016
C255 = CC1210_47UF_10V_20%_X5R: Non-polarised capacitor; Part Description: SMD Multilayer Chip Ceramic Capacitor; Manufacturer: GENERIC; Manufacturer1 Part Number: LMK325BJ476MM-T; Voltage: 10V; TC: X5R; Tolerance: ±20%; Part Number: CC1210_47UF_10V_20%_X5R; Component Kind: Standard; Component Type: Standard; Pin Count: 2; Value: 47uF; Status: None; Manufacturer Part Number: CC1210_47UF_10V_20%_X5R; Case: 1210; Mounted: Yes; Socket: No; SMD: Yes; Sense: No; Manufacturer1 Example: TAIYO YUDEN; Manufacturer1 ComponentHeight: 2.7mm; HelpURL: \\cern.ch\dfs\Applications\Altium\Datasheets\CC1210_X5R_TAIYO-YUDEN_HIGH-VALUE.pdf; Author: CERN DEM JLC; CreateDate: 04.05.2011; LatestRevisionDate: 04.05.2011
C256 = CTE3528-21_22UF_10V_10%_LESR0700: Polarised capacitor; Part Description: Low ESR 0R7 Solid Tantalum Chip Capacitor; Manufacturer: GENERIC; Manufacturer1 Part Number: TPSB226K010R0700; Voltage: 10V; Tolerance: ±10%; Part Number: CTE3528-21_22UF_10V_10%_LESR0700; Component Kind: Standard; Component Type: Standard; Pin Count: 2; Value: 22uF; Status: Preferred; Manufacturer Part Number: CTE3528-21_22UF_10V_10%_LESR0700; Case: B; Mounted: Yes; Socket: No; SMD: Yes; Sense: No; Manufacturer1 Example: AVX; Manufacturer1 ComponentHeight: 2.1mm; HelpURL: \\cern.ch\dfs\Applications\Altium\Datasheets\CTE-LESR_AVX_TPS.pdf; Author: CERN DEM JLC; CreateDate: 05.05.2008; LatestRevisionDate: 20.01.2009
IC25 = TPS62085RLT: 3-A Step-Down Converter With Hiccup Short-Circuit Protection; Manufacturer: Texas Instruments; CompType: IC; PIN_COUNT: 7; PackageReference: RLT0007A; RoHS: Y; RefDes: RefDes; TYPE: TYPE; Value: Value; Manufacturer Part Number: TPS62085RLT
IC26-IC28 = ADP1741ACPZ-R7: 2A, 0.75V to 3.0V Adjustable, Low-Dropout Linear Regulator; Manufacturer: ANALOG DEVICES; PressFit: No; Bonding: No; Part Number: ADP1741ACPZ-R7; Component Kind: Standard; Component Type: Standard; Device: ADP1741ACPZ-R7; PackageDescription: QFN, 0.65mm pitch,square; 4 pin X 4 pin, 4mm X 4mm X 1mm H body (w/thermal tab 2.25 X 2.25mm),  IPC Medium Density; Part Description: 2A, 0.75V to 3.0V Adjustable, Low-Dropout Linear Regulator; Manufacturer Part Number: ADP1741ACPZ-R7; Pin Count: 17; Case: QFN16; Mounted: Yes; Socket: No; SMD: Yes; Sense: No; ComponentHeight: 1mm; HelpURL: \\cern.ch\dfs\Applications\Altium\Datasheets\ADP1741ACPZ-R7.pdf; Author: CERN DEM JLC; CreateDate: 07.02.2012; LatestRevisionDate: 07.02.2012
L5 = IHLP1212AEERR47M11: Inductor, Low DCR Series; Manufacturer: VISHAY; Series Resistance: 15 mOhm; Tolerance: 20%; Saturation  Current: 6.7 A; Value: 470 nH; Manufacturer Part Number: IHLP1212AEERR47M11
L10-L13 L15-L17 = IND0603_MURATA_BLM18SG121TN1D: Inductor; Part Description: SMD EMIFIL Suppression Chip Ferrite Bead; Manufacturer: MURATA; Power: 3A; Resistance: 0.025R; Tolerance: ±25%; Part Number: IND0603_MURATA_BLM18SG121TN1D; Component Kind: Standard; Component Type: Standard; Pin Count: 2; Value: 120R@100MHz; Status: None; Manufacturer Part Number: BLM18SG121TN1D; Case: 0603; Mounted: Yes; Socket: No; SMD: Yes; Sense: No; ComponentHeight: 0.65mm; HelpURL: \\cern.ch\dfs\Applications\Altium\Datasheets\IND0603_MURATA_BLM18S.pdf; Author: CERN DEM JLC; CreateDate: 23.07.2014; LatestRevisionDate: 23.07.2014
L27 = IND_1.5UH_20%_TDK_SPM4020-LR: Inductor With Core; Part Description: SMD Inductor for Power Circuits (Wound Metal), SPM Series; Manufacturer: TDK; Manufacturer Part Number: SPM4020T-1R5M-LR; Power: 6.3A; Resistance: 0.0399R; Tolerance: ±20%; Part Number: IND_1.5UH_20%_TDK_SPM4020-LR; Component Kind: Standard; Component Type: Standard; Footprint: IND_TDK_SPM4020-LR; Pin Count: 2; Value: 1.5uH; Status: None; Mounted: Yes; Socket: No; SMD: Yes; Sense: No; ComponentHeight: 3mm; HelpURL: \\cern.ch\dfs\Applications\Altium\Datasheets\IND_TDK_SPM6530.pdf; Author: CERN DEM MR; CreateDate: 08.11.2016; LatestRevisionDate: 08.11.2016
R89 = R0805_174K_0.1%_0.125W_25PPM: Resistor - 0.1%; Part Description: Thin Film Chip Resistor; Manufacturer: GENERIC; Manufacturer1 Part Number: ERA6AEB1743V; Power: 0.125W; TC: ±25ppm; Part Number: R0805_174K_0.1%_0.125W_25PPM; Component Kind: Standard; Component Type: Standard; Pin Count: 2; Value: 174k; Status: Not recommended; Tolerance: ±0.1%; Manufacturer Part Number: R0805_174K_0.1%_0.125W_25PPM; Case: 0805; Mounted: Yes; Sense: No; Socket: No; SMD: Yes; Manufacturer1 Example: PANASONIC; Manufacturer1 ComponentHeight: 0.6mm; HelpURL: \\cern.ch\dfs\Applications\Altium\Datasheets\R0805_PANASONIC_ERA.pdf; Author: CERN DEM JLC; CreateDate: 20.06.2011; LatestRevisionDate: 20.06.2011
R90 = R0805_162K_0.1%_0.125W_25PPM: Resistor - 0.1%; Part Description: Thin Film Chip Resistor; Manufacturer: GENERIC; Manufacturer1 Part Number: ERA6AEB1623V; Power: 0.125W; TC: ±25ppm; Part Number: R0805_162K_0.1%_0.125W_25PPM; Component Kind: Standard; Component Type: Standard; Pin Count: 2; Value: 162k; Status: Not recommended; Tolerance: ±0.1%; Manufacturer Part Number: R0805_162K_0.1%_0.125W_25PPM; Case: 0805; Mounted: Yes; Sense: No; Socket: No; SMD: Yes; Manufacturer1 Example: PANASONIC; Manufacturer1 ComponentHeight: 0.6mm; HelpURL: \\cern.ch\dfs\Applications\Altium\Datasheets\R0805_PANASONIC_ERA.pdf; Author: CERN DEM JLC; CreateDate: 20.06.2011; LatestRevisionDate: 20.06.2011
R91 R93 = R0603_15K_0.1%_0.063W_10PPM: Resistor - 0.1%; Part Description: Thin Film Chip Resistor; Manufacturer: GENERIC; Manufacturer1 Part Number: RN73C1J15KBTDF; Power: 0.063W; TC: ±10ppm; Part Number: R0603_15K_0.1%_0.063W_10PPM; Component Kind: Standard; Component Type: Standard; Pin Count: 2; Value: 15k; Status: Not recommended; Tolerance: ±0.1%; Manufacturer Part Number: R0603_15K_0.1%_0.063W_10PPM; Case: 0603; Mounted: Yes; Sense: No; Socket: No; SMD: Yes; Manufacturer1 Example: TYCO HOLSWORTHY; Manufacturer1 ComponentHeight: 0.5mm; HelpURL: \\cern.ch\dfs\Applications\Altium\Datasheets\R0603_Tyco_RN73.pdf; Author: CERN DEM JLC; CreateDate: 03.12.2007; LatestRevisionDate: 13.03.2008
R92 R94 = R0603_10K_0.1%_0.063W_10PPM: Resistor - 0.1%; Part Description: Thin Film Chip Resistor; Manufacturer: GENERIC; Manufacturer1 Part Number: RN73C1J10KBTDF; Power: 0.063W; TC: ±10ppm; Part Number: R0603_10K_0.1%_0.063W_10PPM; Component Kind: Standard; Component Type: Standard; Pin Count: 2; Value: 10k; Status: Not recommended; Tolerance: ±0.1%; Manufacturer Part Number: R0603_10K_0.1%_0.063W_10PPM; Case: 0603; Mounted: Yes; Sense: No; Socket: No; SMD: Yes; Manufacturer1 Example: TYCO HOLSWORTHY; Manufacturer1 ComponentHeight: 0.5mm; HelpURL: \\cern.ch\dfs\Applications\Altium\Datasheets\R0603_Tyco_RN73.pdf; Author: CERN DEM JLC; CreateDate: 03.12.2007; LatestRevisionDate: 13.03.2008
R95 = R0603_10K2_0.1%_0.063W_10PPM: Resistor - 0.1%; Part Description: Thin Film Chip Resistor; Manufacturer: GENERIC; Manufacturer1 Part Number: RN73C1J10K2BTDF; Power: 0.063W; TC: ±10ppm; Part Number: R0603_10K2_0.1%_0.063W_10PPM; Component Kind: Standard; Component Type: Standard; Pin Count: 2; Value: 10k2; Status: Not recommended; Tolerance: ±0.1%; Manufacturer Part Number: R0603_10K2_0.1%_0.063W_10PPM; Case: 0603; Mounted: Yes; Sense: No; Socket: No; SMD: Yes; Manufacturer1 Example: TYCO HOLSWORTHY; Manufacturer1 ComponentHeight: 0.5mm; HelpURL: \\cern.ch\dfs\Applications\Altium\Datasheets\R0603_Tyco_RN73.pdf; Author: CERN DEM JLC; CreateDate: 03.12.2007; LatestRevisionDate: 13.03.2008
R96 = R0603_2K55_0.1%_0.063W_10PPM: Resistor - 0.1%; Part Description: Thin Film Chip Resistor; Manufacturer: GENERIC; Manufacturer1 Part Number: RN73C1J2K55BTDF; Power: 0.063W; TC: ±10ppm; Part Number: R0603_2K55_0.1%_0.063W_10PPM; Component Kind: Standard; Component Type: Standard; Pin Count: 2; Value: 2k55; Status: Not recommended; Tolerance: ±0.1%; Manufacturer Part Number: R0603_2K55_0.1%_0.063W_10PPM; Case: 0603; Mounted: Yes; Sense: No; Socket: No; SMD: Yes; Manufacturer1 Example: TYCO HOLSWORTHY; Manufacturer1 ComponentHeight: 0.5mm; HelpURL: \\cern.ch\dfs\Applications\Altium\Datasheets\R0603_Tyco_RN73.pdf; Author: CERN DEM JLC; CreateDate: 03.12.2007; LatestRevisionDate: 13.03.2008

## Sheet VOLTAGE_MONITOR.SchDoc: Voltage Monitor
size A3; Author: Wojciech Ruc³o; Organization: Warsaw Univeristy of Technology; Address1: Nowowiejska 15/19; DocumentNumber: 11; Revision: 1.0; SheetNumber: 11; SheetTotal: 12
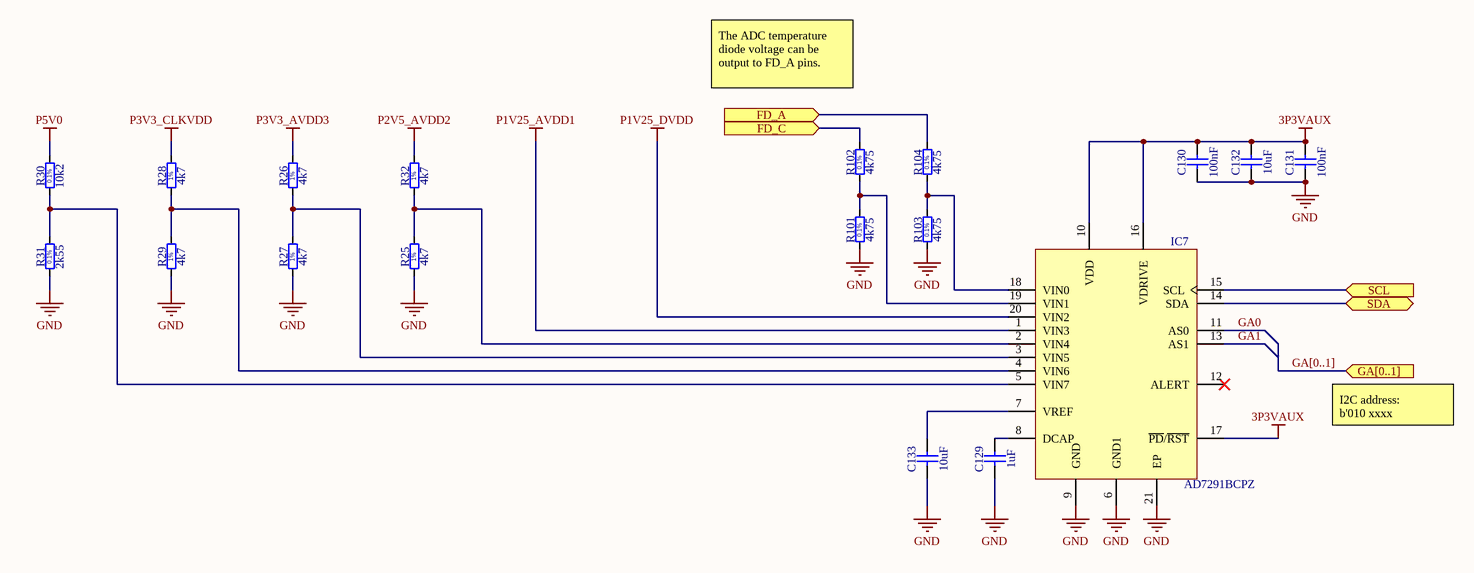
[diagram p9: VOLTAGE_MONITOR.SchDoc]

### Parts
C129  1uF  [CAPC1005X55N]
C130  100nF  [CAPC0603X33N]
C131  100nF  [CAPC0603X33N]
C132  10uF  [CAPC1608X87N]
C133  10uF  [CAPC1608X87N]
IC7  AD7291BCPZ  [CP_20_8]
R25  4k7  [RESC1005X40N]
R26  4k7  [RESC1005X40N]
R27  4k7  [RESC1005X40N]
R28  4k7  [RESC1005X40N]
R29  4k7  [RESC1005X40N]
R30  10k2  [RESC1608X55N]
R31  2k55  [RESC1608X55N]
R32  4k7  [RESC1005X40N]
R101  4k75  [RESC1005X35N]
R102  4k75  [RESC1005X35N]
R103  4k75  [RESC1005X35N]
R104  4k75  [RESC1005X35N]

### Ports
FD_A (in), FD_C (in), GA[0..1] (in), SCL (in), SDA (bidir)

### Nets
3P3VAUX: C130.2 C131.2 C132.2 IC7.10(VDD) IC7.16(VDRIVE) IC7.17(~{PD}/~{RST})
GND: C129.1 C130.1 C131.1 C132.1 C133.1 IC7.6(GND1) IC7.9(GND) IC7.21(EP) R25.1 R27.1 R29.1 R31.1 R101.1 R103.1
P1V25_AVDD1: IC7.1(VIN3)
P1V25_DVDD: IC7.20(VIN2)
P2V5_AVDD2: R32.2
P3V3_AVDD3: R26.2
P3V3_CLKVDD: R28.2
P5V0: R30.2
FD_A: R104.2 ; port FD_A
FD_C: R102.2 ; port FD_C
GA0: IC7.11(AS0)
GA1: IC7.13(AS1)
SCL: IC7.15(SCL) ; port SCL
SDA: IC7.14(SDA) ; port SDA
NetC129_2: C129.2 IC7.8(DCAP)
NetC133_2: C133.2 IC7.7(VREF)
NetIC7_2: IC7.2(VIN4) R25.2 R32.1
NetIC7_3: IC7.3(VIN5) R26.1 R27.2
NetIC7_4: IC7.4(VIN6) R28.1 R29.2
NetIC7_5: IC7.5(VIN7) R30.1 R31.2
NetIC7_18: IC7.18(VIN0) R103.2 R104.1
NetIC7_19: IC7.19(VIN1) R101.2 R102.1

Not connected (* = marked no-connect by the designer): IC7 12(ALERT)*

### Buses and harness runs
bus GA[0..1] = port GA[0..1]

### Notes on the sheet
- The ADC temperature diode voltage can be output to FD_A pins.
- I2C address:
  b'010 xxxx
- Title
- Size:
- Date:
- A3
- Number:
- Revision:
- Sheet
- of
- Drawn by:
- File:
- (in symbol R0402_4K7_1%_0.0625W_100PPM) 1%
- (in symbol R0402_4K75_0.1%_0.063W_25PPM) 0.1%
- (in symbol R0603_2K55_0.1%_0.063W_10PPM) 0.1%
- (in symbol R0603_10K2_0.1%_0.063W_10PPM) 0.1%

### Library data of the parts
C129 = CC0402_1UF_16V_10%_X5R: Non-polarised capacitor; Part Description: SMD Multilayer Chip Ceramic Capacitor; Manufacturer: GENERIC; Manufacturer1 Part Number: C1005X5R1C105KT; Tolerance: ±10%; Voltage: 16V; TC: X5R; Value: 1uF; Part Number: CC0402_1UF_16V_10%_X5R; Component Kind: Standard; Component Type: Standard; Pin Count: 2; Status: Preferred; Manufacturer Part Number: CC0402_1UF_16V_10%_X5R; Case: 0402; Mounted: Yes; Socket: No; SMD: Yes; Sense: No; Manufacturer1 Example: TDK; Manufacturer1 ComponentHeight: 0.55mm; HelpURL: \\cern.ch\dfs\Applications\Altium\Datasheets\CC0402_X5R_TDK_C.pdf; Author: CERN DEM JLC; CreateDate: 25.10.2012; LatestRevisionDate: 25.10.2012
C130 C131 = CC0201_100NF_6.3V_10%_X5R: as C44-C62 on sheet CLOCK; Value: 100nF; Part Number: CC0201_100NF_6.3V_10%_X5R; Component Kind: Standard; Component Type: Standard; Pin Count: 2; Status: Not Recommended; Manufacturer Part Number: CC0201_100NF_6.3V_10%_X5R; Case: 0201; Mounted: Yes; Socket: No; SMD: Yes; Sense: No; Manufacturer1 Example: AVX; Manufacturer1 ComponentHeight: 0.33mm; HelpURL: \\cern.ch\dfs\Applications\Altium\Datasheets\CC0201_X5R_AVX.pdf; Author: CERN DEM JLC; CreateDate: 03.12.2007; LatestRevisionDate: 03.12.2007
C132 C133 = CC0603_10UF_6.3V_20%_X5R: Non-polarised capacitor; Part Description: SMD Multilayer Chip Ceramic Capacitor; Manufacturer: GENERIC; Manufacturer1 Part Number: C0603C106M9PAC; Tolerance: ±20%; Voltage: 6.3V; TC: X5R; Value: 10uF; Part Number: CC0603_10UF_6.3V_20%_X5R; Component Kind: Standard; Component Type: Standard; Pin Count: 2; Status: Preferred; Manufacturer Part Number: CC0603_10uF_6.3V_20%_X5R; Case: 0603; Mounted: Yes; Socket: No; SMD: Yes; Sense: No; Manufacturer1 Example: KEMET; Manufacturer1 ComponentHeight: 0.95mm; HelpURL: \\cern.ch\dfs\Applications\Altium\Datasheets\CC0603_X5R_KEMET.pdf; Author: CERN DEM JLC; CreateDate: 03.12.2007; LatestRevisionDate: 03.12.2007
IC7 = AD7291BCPZ: 8-Channel, I2C, 12-Bit SAR ADC with Temperature Sensor; Generic Part Number: AD7291; Manufacturer: Analog Devices; Packing: Tray; Throughput Rate (SPS): 22.2K; Resolution (Bits): 12; Interface: I2C/Ser 2-Wire, Ser; Channels: 8; ComponentLink3Description: Package Specification; ComponentLink1Description: Manufacturer URL; Code_JEDEC: MO-220-WGGD; RoHS: Y; ComponentLink4URL: http://www.analog.com/en/analog-to-digital-converters/ad-converters/ad7291/products/product.html; PackageDescription: 20-Lead Lead Frame Chip Scale Package [LFCSP_WQ] 4 x 4 mm Body, Very Very Thin Quad; ComponentLink2Description: Datasheet; PackageReference: CP-20-8; ComponentLink2URL: http://www.analog.com/static/imported-files/data_sheets/AD7291.pdf; ComponentLink4Description: Product URL; ComponentLink3URL: http://www.analog.com/static/imported-files/packages/PKG_PDF/LFCSP(CP)/CP-20/CP_20_8.pdf; PackageVersion: 020509-B; ComponentLink1URL: http://www.analog.com/en/index.html; Mounting Technology: Surface Mount; Manufacturer Part Number: AD7291BCPZ
R25-R29 R32 = R0402_4K7_1%_0.0625W_100PPM: Resistor - 1%; Part Description: General Purpose Thick Film Chip Resistor; Manufacturer: GENERIC; Manufacturer1 Part Number: 232270674702L; TC: ±100ppm/°C; Value: 4k7; Power: 0.0625W; Tolerance: ±1%; Part Number: R0402_4K7_1%_0.0625W_100PPM; Component Kind: Standard; Component Type: Standard; Pin Count: 2; Status: Not recommended; Manufacturer Part Number: R0402_4K7_1%_0.0625W_100PPM; Case: 0402; Mounted: Yes; Sense: No; Socket: No; SMD: Yes; Manufacturer1 Example: YAGEO PHYCOMP; Manufacturer1 ComponentHeight: 0.4mm; HelpURL: \\cern.ch\dfs\Applications\Altium\Datasheets\R0402_Phycomp_RC0402.pdf; Author: CERN DEM JLC; CreateDate: 03.12.2007; LatestRevisionDate: 17.10.2012
R30 = R0603_10K2_0.1%_0.063W_10PPM: as R95 on sheet POWER_SUPPLY_2; Part Number: R0603_10K2_0.1%_0.063W_10PPM; Component Kind: Standard; Component Type: Standard; Pin Count: 2; Value: 10k2; Status: Not recommended; Tolerance: ±0.1%; Manufacturer Part Number: R0603_10K2_0.1%_0.063W_10PPM; Case: 0603; Mounted: Yes; Sense: No; Socket: No; SMD: Yes; Manufacturer1 Example: TYCO HOLSWORTHY; Manufacturer1 ComponentHeight: 0.5mm; HelpURL: \\cern.ch\dfs\Applications\Altium\Datasheets\R0603_Tyco_RN73.pdf; Author: CERN DEM JLC; CreateDate: 03.12.2007; LatestRevisionDate: 13.03.2008
R31 = R0603_2K55_0.1%_0.063W_10PPM: as R96 on sheet POWER_SUPPLY_2; Part Number: R0603_2K55_0.1%_0.063W_10PPM; Component Kind: Standard; Component Type: Standard; Pin Count: 2; Value: 2k55; Status: Not recommended; Tolerance: ±0.1%; Manufacturer Part Number: R0603_2K55_0.1%_0.063W_10PPM; Case: 0603; Mounted: Yes; Sense: No; Socket: No; SMD: Yes; Manufacturer1 Example: TYCO HOLSWORTHY; Manufacturer1 ComponentHeight: 0.5mm; HelpURL: \\cern.ch\dfs\Applications\Altium\Datasheets\R0603_Tyco_RN73.pdf; Author: CERN DEM JLC; CreateDate: 03.12.2007; LatestRevisionDate: 13.03.2008
R101-R104 = R0402_4K75_0.1%_0.063W_25PPM: Resistor - 0.1%; Part Description: Thin Film Precision Resistor; Manufacturer: GENERIC; Manufacturer1 Part Number: CPF0402B4K75E1; Power: 0.063W; TC: ±25ppm/°C; Part Number: R0402_4K75_0.1%_0.063W_25PPM; Component Kind: Standard; Component Type: Standard; Pin Count: 2; Value: 4k75; Status: Not Recommended; Tolerance: ±0.1%; Manufacturer Part Number: R0402_4K75_0.1%_0.063W_25PPM; Case: 0402; Mounted: Yes; Sense: No; Socket: No; SMD: Yes; Manufacturer1 Example: TE CONNECTIVITY; Manufacturer1 ComponentHeight: 0.35mm; HelpURL: \\cern.ch\dfs\Applications\Altium\Datasheets\R0402_TYCO_CPF.pdf; Author: CERN DEM JMW; CreateDate: 22.09.2015; LatestRevisionDate: 22.09.2015